# EAGLE design Julia ABL Board V2.1 (EAGLE 9.6.2)
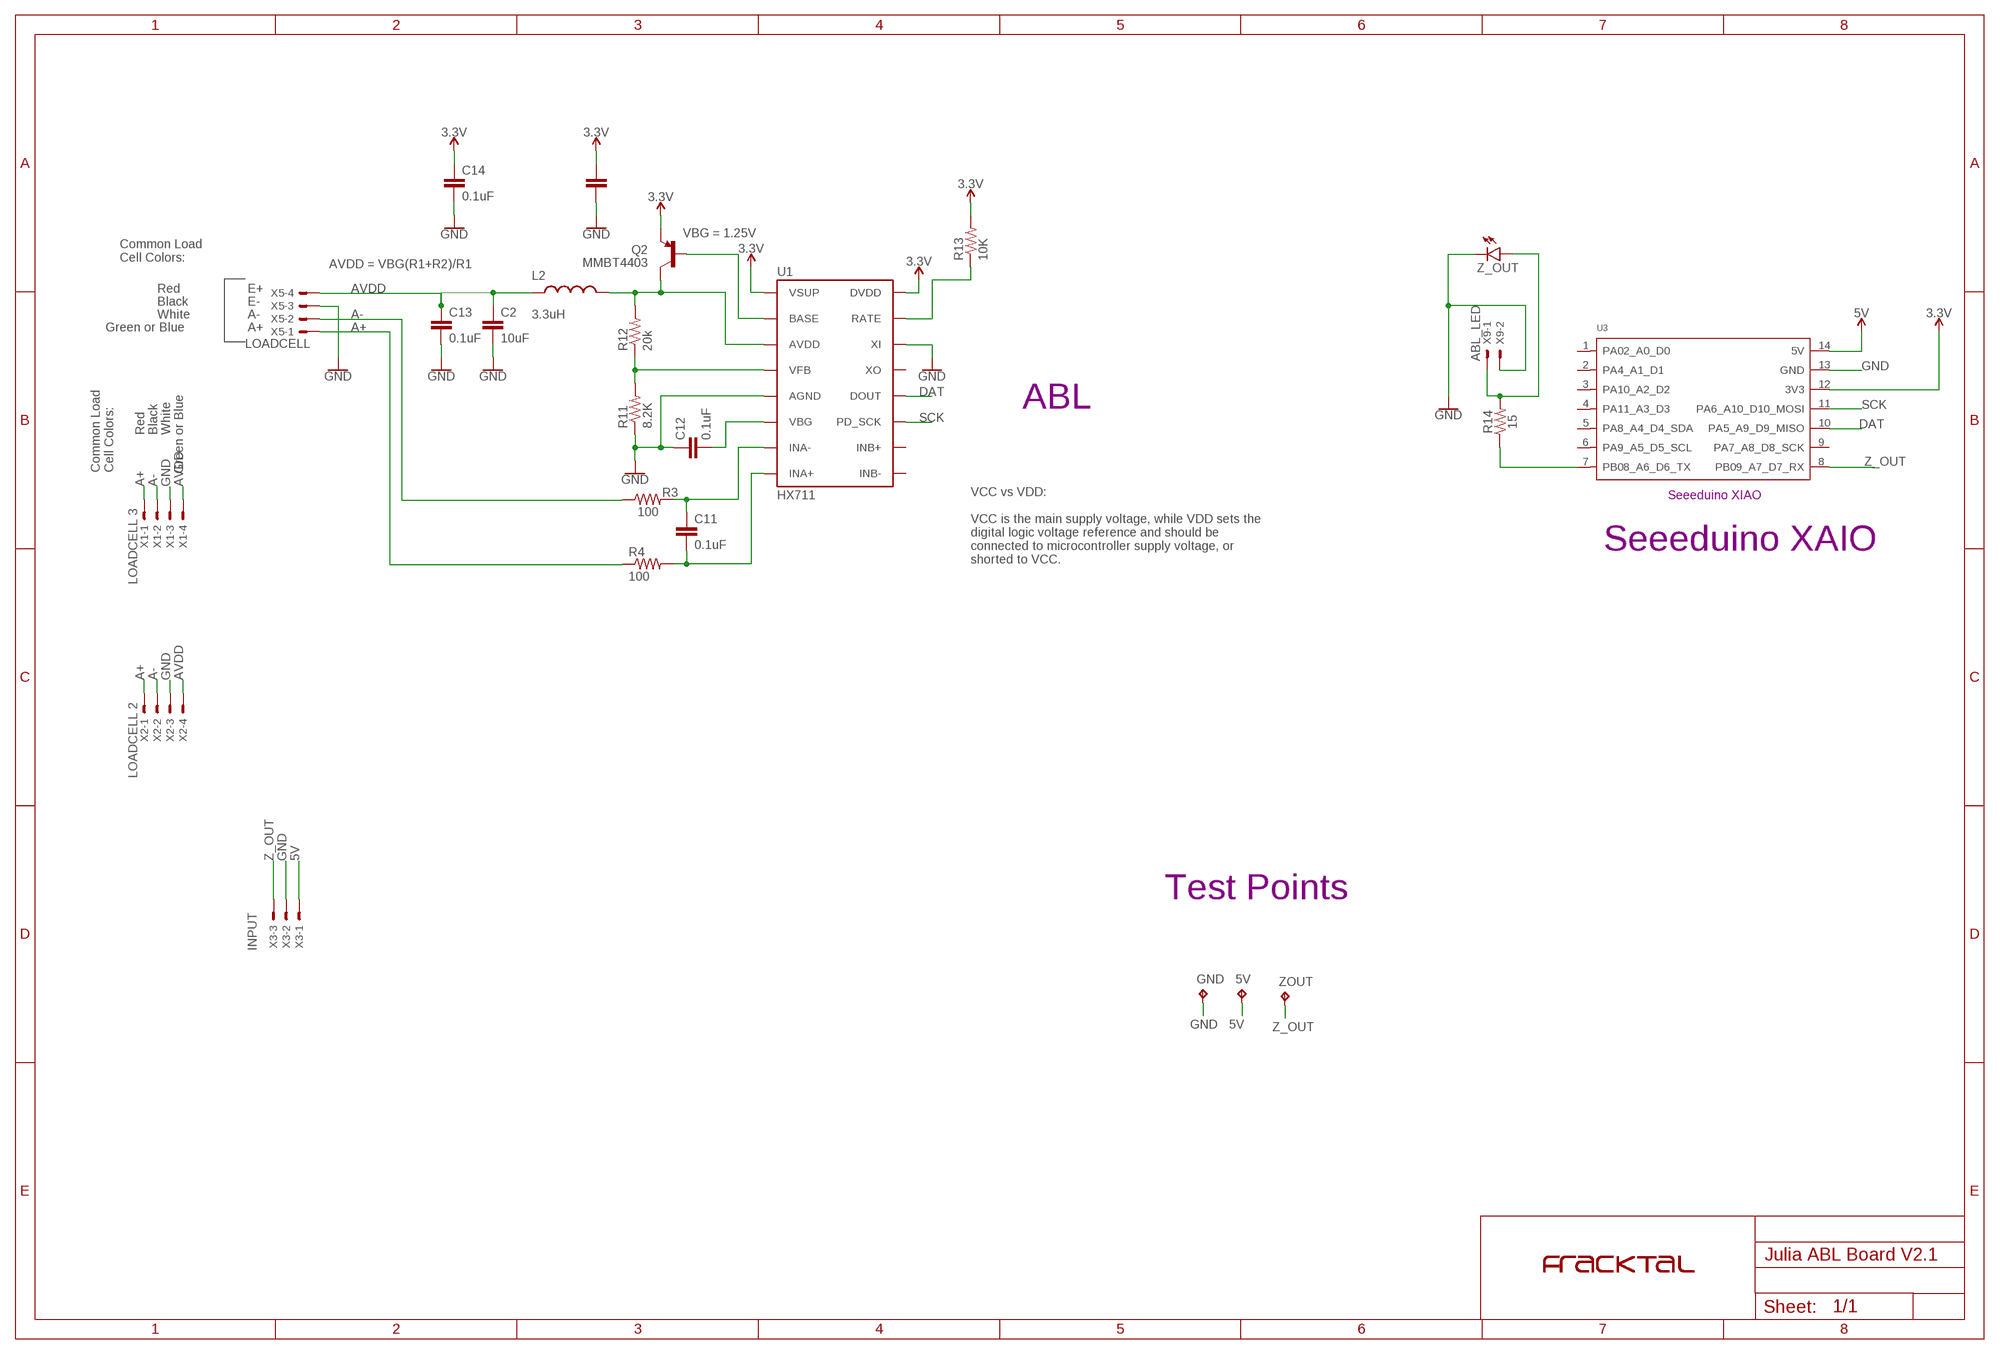
[diagram p0: schematic, sheet 1]

## Parts
5V  TPB2,54  [B2,54]
C1  10uF  10UF50V20%(1210)  [1210]
C2  10uF  10UF50V20%(1210)  [1210]
C11  0.1uF  0.1UF-25V-5%(0603)  [0603-CAP]
C12  0.1uF  0.1UF-25V-5%(0603)  [0603-CAP]
C13  0.1uF  0.1UF-25V-5%(0603)  [0603-CAP]
C14  0.1uF  0.1UF-25V-5%(0603)  [0603-CAP]
GND  TPB2,54  [B2,54]
L2  3.3uH  INDUCTOR0805-IND  [0805]
Q2  MMBT4403  TRANSISTOR_PNPMMBT4403  [SOT23-3]
R3  100  100OHM-1/10W-1%(0603)  [0603-RES]
R4  100  100OHM-1/10W-1%(0603)  [0603-RES]
R11  8.2K  8.2KOHM-1/10W-5%(0603)  [0603-RES]
R12  20k  20KOHM1/10W1%(0603)  [0603-RES]
R13  10K  10KOHM-1/10W-1%(0603)0603  [0603-RES]
R14  15  RESISTOR0603  [0603]
U1  HX711  HX711HX711  [SO16]
U3  MOUDLE-SEEEDUINO-XIAO  [MOUDLE14P-2.54-21X17.8MM]
U$2  FRACKTALLOGO  [FRACKTALLOGO]
X1  LOADCELL 3  JST-XH-04-PIN-LONG-PAD  [JST-XH-04-PACKAGE-LONG-PAD]
X2  LOADCELL 2  JST-XH-04-PIN-LONG-PAD  [JST-XH-04-PACKAGE-LONG-PAD]
X3  JST-XH-03-PIN-LONG-PAD  [JST-XH-03-PACKAGE-LONG-PAD]
X5  LOADCELL  JST-XH-04-PIN-LONG-PAD  [JST-XH-04-PACKAGE-LONG-PAD]
X9  ABL_LED  JST-XH-02-PIN-LONG-PAD  [JST-XH-02-PACKAGE-LONG-PAD]
Z_OUT  LEDSML0603  [SML0603]
ZOUT  TPB2,54  [B2,54]

## Nets
3.3V: C1.1 C14.1 Q2.2(E) R13.2 U1.1(VSUP) U1.16(DVDD) U3.12(3V3)
5V: 5V.TP U3.14(5V) X3.1
A+: R4.1 X1.1 X2.1 X5.1
A-: R3.1 X1.2 X2.2 X5.2
AVDD: C2.1 C13.1 L2.1 X1.4 X2.4 X5.4
DAT: U1.12(DOUT) U3.10(PA5_A9_D9_MISO)
GND: C1.2 C2.2 C12.1 C13.2 C14.2 GND.TP R11.1 U1.5(AGND) U1.14(XI) U3.13(GND) X1.3 X2.3 X3.2 X5.3 X9.2 Z_OUT.C
N$9: Q2.1(B) U1.2(BASE)
N$10: R11.2 R12.1 U1.4(VFB)
N$11: C12.2 U1.6(VBG)
N$12: L2.2 Q2.3(C) R12.2 U1.3(AVDD)
N$13: R13.1 U1.15(RATE)
N$15: C11.1 R3.2 U1.7(INA-)
N$16: C11.2 R4.2 U1.8(INA+)
N$17: R14.2 X9.1 Z_OUT.A
N$18: R14.1 U3.7(PB08_A6_D6_TX)
SCK: U1.11(PD_SCK) U3.11(PA6_A10_D10_MOSI)
Z_OUT: U3.8(PB09_A7_D7_RX) X3.3 ZOUT.TP
Unconnected: U1.9(INB-) U1.10(INB+) U1.13(XO) U3.1(PA02_A0_D0) U3.2(PA4_A1_D1) U3.3(PA10_A2_D2) U3.4(PA11_A3_D3) U3.5(PA8_A4_D4_SDA) U3.6(PA9_A5_D5_SCL) U3.9(PA7_A8_D8_SCK)

## Notes on the sheet
- VBG = 1.25V
- Common Load
  Cell Colors:
- AVDD = VBG(R1+R2)/R1
- Red | E+
- Black | E-
- White | A-
- Green or Blue | A+
- ABL
- Red | Black | White
- Common Load
  Cell Colors:
- Green or Blue
- Seeeduino XIAO
- Seeeduino XAIO
- VCC vs VDD:
  
  VCC is the main supply voltage, while VDD sets the
  digital logic voltage reference and should be
  connected to microcontroller supply voltage, or
  shorted to VCC.
- Test Points

## Library data of the parts
5V GND ZOUT = testpad:TP: Test pad
C1 C2 = SparkFun-Capacitors:10UF50V20%(1210): CAP-09824; PROD_ID: CAP-09824
C11-C14 = SparkFun-Capacitors:0.1UF-25V-5%(0603): CAP-08604; PROD_ID: CAP-08604
L2 = SparkFun-Passives:INDUCTOR: Inductors Basic Inductor/Choke - 0603 and 1206. Footprints are not proven and vary greatly between part numbers. INDUCTOR POWER 3.3UH 4.0A SMD 0.197" L x 0.197" W x 0.177" H (5.00mm x 5.00mm x 4.50mm); PROD_ID: NDUC-13076
Q2 = SparkFun-DiscreteSemi:TRANSISTOR_PNP: Generic PNP BJT Double check pinouts against datasheets- not all devices are the same! MMBT3906 - 40V 200mA SOT-23 (TRANS-08052) MMBT4403 - 40V 600mA SOT-23 (TRANS-09245); PROD_ID: TRANS-09245
R3 R4 = SparkFun-Resistors:100OHM-1/10W-1%(0603): RES-07863; PROD_ID: RES-07863
R11 = SparkFun-Resistors:8.2KOHM-1/10W-5%(0603): RES-10646; PROD_ID: RES-10646
R12 = SparkFun-Resistors:20KOHM1/10W1%(0603): RES-09383; PROD_ID: RES-09383
R13 = SparkFun-Resistors:10KOHM-1/10W-1%(0603): RES-00824; PROD_ID: RES-00824
R14 = SparkFun-Resistors:RESISTOR: Generic Resistor Package
U1 = Testing:HX711; PROD_ID: IC-12445
U3 = Seeeduino XIAO:MOUDLE-SEEEDUINO-XIAO
U$2 = FracktalWorks_Eagle_Library:FRACKTALLOGO
X1 X2 X5 = Rembrandt Electronics - JST XH Connectors v1-0:JST-XH-04-PIN: JST XH Connector 2 Pin Wire to board connector. Pitch: 2,54 mm, (0.100") Number of pins: 4 Created by Rembrandt Electronics www.rembrandtelectronics.com
X3 = Rembrandt Electronics - JST XH Connectors v1-0:JST-XH-03-PIN: JST XH Connector 2 Pin Wire to board connector. Pitch: 2,54 mm, (0.100") Number of pins: 3 Created by Rembrandt Electronics www.rembrandtelectronics.com; VALUE1: INPUT
X9 = Rembrandt Electronics - JST XH Connectors v1-0:JST-XH-02-PIN: JST XH Connector 2 Pin Wire to board connector. Pitch: 2,54 mm, (0.100") Number of pins: 2 Created by Rembrandt Electronics www.rembrandtelectronics.com
Z_OUT = led:LED: LED OSRAM: - CHIPLED LG R971, LG N971, LY N971, LG Q971, LY Q971, LO R971, LY R971 LH N974, LH R974 LS Q976, LO Q976, LY Q976 LO Q996 - Hyper CHIPLED LW Q18S LB Q993, LB Q99A, LB R99A - SideLED LS A670, LO A670, LY A670, LG A670, LP A670 LB A673, LV A673, LT A673, LW A673 LH A674 LY A675 LS A676, LA A676, LO A676, LY A676, LW A676 LS A679, LY A679, LG A679 - Hyper Micro SIDELED® LS Y876, LA Y876, LO Y876, LY Y876 LT Y87S - SmartLED LW L88C, LW L88S LB L89C, LB L89S, LG L890 LS L89K, LO L89K, LY L89K LS L896, LA L896, LO L896, LY L896 - TOPLED LS T670, LO T670, LY T670, LG T670, LP T670 LSG T670, LSP T670, LSY T670, LOP T670, LYG T670 LG T671, LOG T671, LSG T671 LB T673, LV T673, LT T673, LW T673 LH T674 LS T676, LA T676, LO T676, LY T676, LB T676, LH T676, LSB T676, LW T676 LB T67C, LV T67C, LT T67C, LS T67K, LO T67K, LY T67K, LW E67C LS E67B, LA E67B, LO E67B, LY E67B, LB E67C, LV E67C, LT E67C LW T67C LS T679, LY T679, LG T679 LS T770, LO T770, LY T770, LG T770, LP T770 LB T773, LV T773, LT T773, LW T773 LH T774 LS E675, LA E675, LY E675, LS T675 LS T776, LA T776, LO T776, LY T776, LB T776 LHGB T686 LT T68C, LB T68C - Hyper Mini TOPLED® LB M676 - Mini TOPLED Santana® LG M470 LS M47K, LO M47K, LY M47K Source: http://www.osram.convergy.de LUXEON: - LUMILED® LXK2-PW12-R00, LXK2-PW12-S00, LXK2-PW14-U00, LXK2-PW14-V00 LXK2-PM12-R00, LXK2-PM12-S00, LXK2-PM14-U00 LXK2-PE12-Q00, LXK2-PE12-R00, LXK2-PE12-S00, LXK2-PE14-T00, LXK2-PE14-U00 LXK2-PB12-K00, LXK2-PB12-L00, LXK2-PB12-M00, LXK2-PB14-N00, LXK2-PB14-P00, LXK2-PB14-Q00 LXK2-PR12-L00, LXK2-PR12-M00, LXK2-PR14-Q00, LXK2-PR14-R00 LXK2-PD12-Q00, LXK2-PD12-R00, LXK2-PD12-S00 LXK2-PH12-R00, LXK2-PH12-S00 LXK2-PL12-P00, LXK2-PL12-Q00, LXK2-PL12-R00 Source: www.luxeon.com KINGBRIGHT: KA-3528ASYC Source: www.kingbright.com

## Board
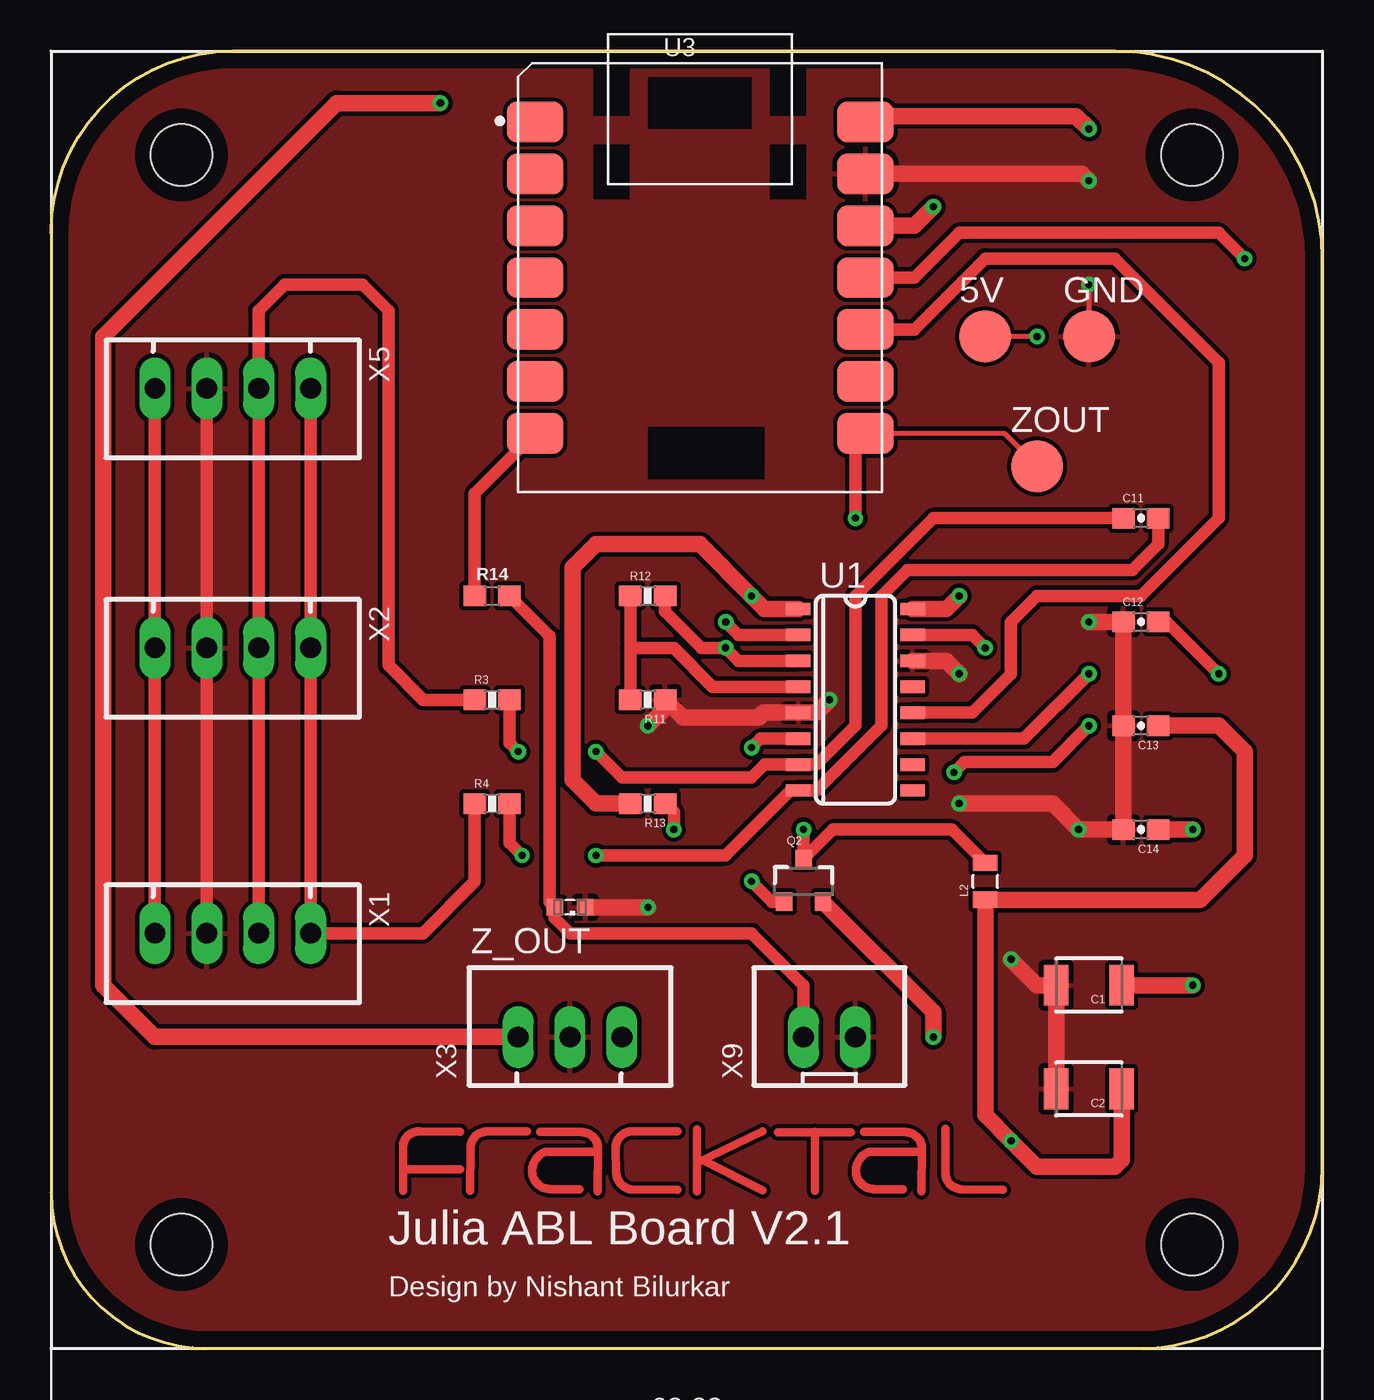
[diagram p1: board, top side]
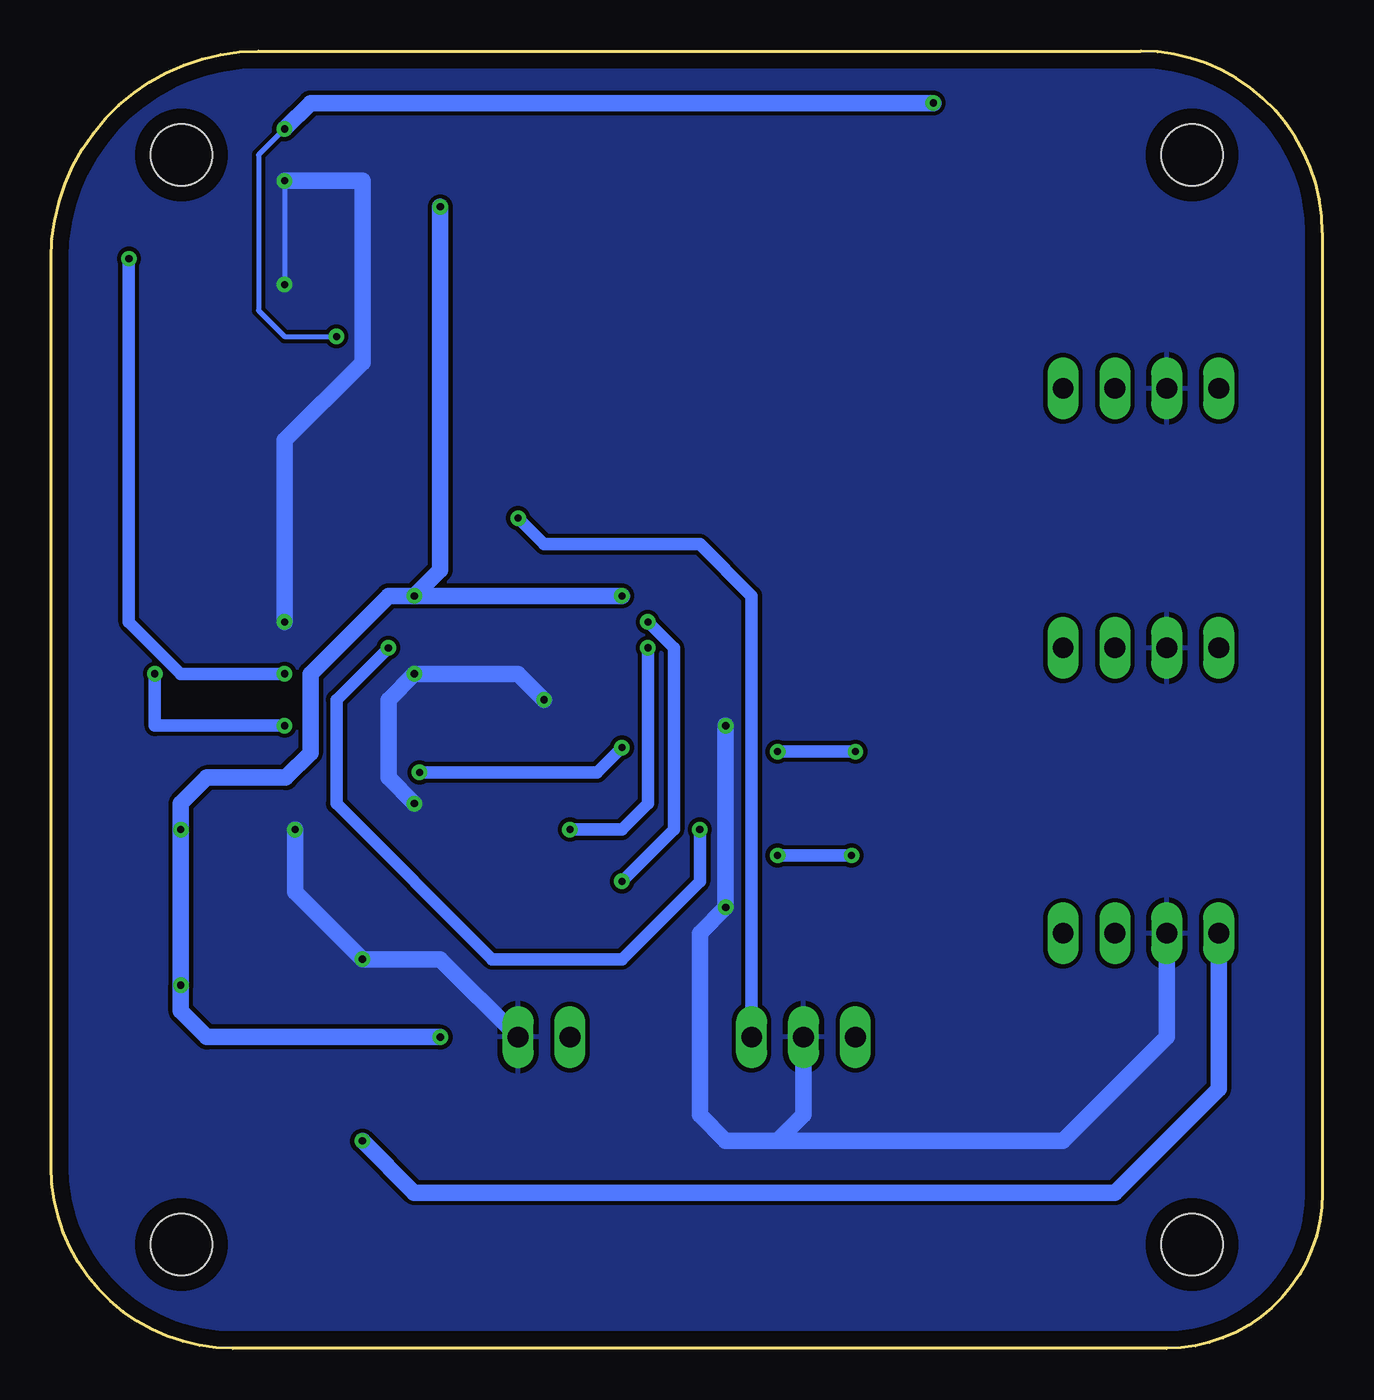
[diagram p2: board, bottom side, seen from below]

Size 62.23 x 63.5 mm. Coordinates in mm from the lower left corner, seen from the top.
Outline: 0,54.61 0,7.62 arc90 7.62,0 53.34,0 arc90 62.23,8.89 62.23,53.34 arc90 52.07,63.5 8.89,63.5 arc90 0,54.61
Copper layers (1*16): Top 0.035mm / dielectric 1.5mm / Bottom 0.035mm
Design rules "LionCircuits": minimum track width 8mil, minimum drill 0.35mm, track to track 8mil, track to pad 8mil, pad to pad 8mil, via to via 8mil, smd to smd 8mil, copper to edge 30mil, drill to drill 10mil, minimum pad ring 10mil, minimum via ring 8mil, stop-mask expansion 4mil, vias tented up to drill 0mil, thermal gap 10mil
Holes 3 mm at 6.38,58.42 6.38,5.08 55.85,5.08 55.85,58.42

### Footprints (pad centres in the part's own frame; a part is rotated, then mirrored left to right if it is on the bottom)
B2,54 = smd 2.54 x 2.54: TP 0,0
1210 = smd 1.2 x 2: 1 -1.6,0; 2 1.6,0
0603-CAP = smd 1.1 x 1: 1 -0.85,0; 2 0.85,0
0805 = smd 0.8 x 1.2: 1 -0.9,0; 2 0.9,0
SOT23-3 = smd 0.8 x 0.9: 1 -0.95,-1; 2 0.95,-1; 3 0,1.1
0603-RES = smd 1.1 x 1: 1 -0.85,0; 2 0.85,0
0603 = smd 1.1 x 1: 1 -0.85,0; 2 0.85,0
SO16 = smd 0.6 x 1.2: 1 -4.445,-2.8; 2 -3.175,-2.8; 3 -1.905,-2.8; 4 -0.635,-2.8; 5 0.635,-2.8; 6 1.905,-2.8; 7 3.175,-2.8; 8 4.445,-2.8; 9 4.445,2.8; 10 3.175,2.8; 11 1.905,2.8; 12 0.635,2.8; 13 -0.635,2.8; 14 -1.905,2.8; 15 -3.175,2.8; 16 -4.445,2.8
MOUDLE14P-2.54-21X17.8MM = smd 2.75 x 2: 1 0.835,18.12; 2 0.835,15.58; 3 0.835,13.04; 4 0.835,10.5; 5 0.835,7.96; 6 0.835,5.42; 7 0.835,2.88; 8 17,2.88; 9 17,5.42; 10 17,7.96; 11 17,10.5; 12 17,13.04; 13 17,15.58; 14 17,18.12
JST-XH-04-PACKAGE-LONG-PAD = drill 1.016 long: 1 -3.81,0; 2 -1.27,0; 3 1.27,0; 4 3.81,0
JST-XH-03-PACKAGE-LONG-PAD = drill 1.016 long: 1 -2.54,0; 2 0,0; 3 2.54,0
JST-XH-02-PACKAGE-LONG-PAD = drill 1.016 long: 1 -1.27,0; 2 1.27,0
SML0603 = smd 0.8 x 0.8: A 0.75,0; C -0.75,0

### Placement (x,y rotation side)
5V  45.72,49.53 0 top
C1  50.8,17.78 180 top
C2  50.8,12.7 180 top
C11  53.34,40.64 0 top
C12  53.34,35.56 0 top
C13  53.34,30.48 180 top
C14  53.34,25.4 180 top
GND  50.8,49.53 0 top
L2  45.72,22.86 90 top
Q2  36.83,22.86 0 top
R3  21.59,31.75 0 top
R4  21.59,26.67 0 top
R11  29.21,31.75 180 top
R12  29.21,36.83 0 top
R13  29.21,26.67 180 top
R14  21.59,36.83 0 top
U1  39.37,31.75 270 top
U3  22.86,41.91 0 top
U$2  29.21,7.62 0 top
X1  8.89,20.32 180 top
X2  8.89,34.29 180 top
X3  25.4,15.24 0 top
X5  8.89,46.99 180 top
X9  38.1,15.24 0 top
Z_OUT  25.4,21.59 180 top
ZOUT  48.26,43.18 0 top

### Tracks (layer width: path | path; a pad name or v marks a point on that pad's centre or on a via)
3.3V  (via drill 0.35)
  Top 0.813: C14.1 v55.88,25.4 | v55.88,17.78 C1.1 | U3.12 42.25,54.95 v43.18,55.88 | v44.45,36.83 43.81,36.19 U1.16 | U1.1 34.92,36.19 v34.29,36.83 31.75,39.37 26.67,39.37 25.51,38.21 25.51,27.83 26.67,26.67 R13.2 | Q2.2 43.18,16.46 v43.18,15.24
  Bottom 0.813: v43.18,55.88 43.18,38.1 v44.45,36.83 | v34.29,36.83 v44.45,36.83 | v44.45,36.83 45.72,36.83 49.53,33.02 49.53,29.15 50.74,27.94 54.61,27.94 55.88,26.67 v55.88,25.4 v55.88,17.78 55.88,16.51 54.61,15.24 v43.18,15.24
5V  (via drill 0.35)
  Top 0.254: v48.26,49.53 5V.TP
  Top 0.813: X3.1 5.08,15.24 2.54,17.78 2.54,49.53 13.97,60.96 v19.05,60.96 | U3.14 40.15,60.32 50.17,60.32 v50.8,59.69
  Bottom 0.254: v50.8,59.69 52.07,58.42 52.07,50.8 50.8,49.53 v48.26,49.53
  Bottom 0.813: v19.05,60.96 49.53,60.96 v50.8,59.69
A+
  Top 0.61: X5.1 X2.1 X1.1 18.2,20.32 20.74,22.86 R4.1
A-
  Top 0.61: X1.2 X2.2 X5.2 10.16,50.8 11.43,52.07 15.24,52.07 16.51,50.8 16.51,33.44 18.2,31.75 R3.1
AVDD  (via drill 0.35)
  Top 0.61: X5.4 X2.4 X1.4
  Top 0.813: C2.1 52.4,9.22 52.07,8.89 48.26,8.89 v46.99,10.16 45.72,11.43 L2.1 56.25,21.96 58.42,24.13 58.42,29.21 57.15,30.48 C13.1
  Bottom 0.813: X1.4 5.08,12.7 10.16,7.62 44.45,7.62 v46.99,10.16
DAT
  Top 0.61: U3.10 42.25,49.87 45.72,53.34 52.07,53.34 57.15,48.26 57.15,40.64 53.34,36.83 48.26,36.83 46.99,35.56 46.99,33.02 45.09,31.11 U1.12
GND  (via drill 0.35)
  Top 0.254: v50.8,52.07 GND.TP
  Top 0.61: X5.3 X2.3 X1.3
  Top 0.813: v46.99,19.05 48.26,17.78 C1.2 C2.2 | Z_OUT.C v29.21,21.59 | v29.21,30.48 30.06,31.33 R11.1 30.92,30.89 34.65,30.89 34.88,31.11 U1.5 37.46,31.11 v38.1,31.75 | U1.14 43.81,33.66 v44.45,33.02 | v50.8,35.56 C12.1 C13.2 C14.2 v50.29,25.4 49.02,26.67 v44.45,26.67 | U3.13 50.46,57.49 v50.8,57.15
  Bottom 0.254: v50.8,57.15 v50.8,52.07
  Bottom 0.813: X9.2 43.18,19.05 v46.99,19.05 50.29,22.35 v50.29,25.4 | 26.67,10.16 29.21,10.16 30.48,11.43 30.48,20.32 v29.21,21.59 v29.21,30.48 | 26.67,10.16 25.4,11.43 X3.2 | X1.3 7.62,15.24 12.7,10.16 26.67,10.16 | v44.45,26.67 45.72,27.94 45.72,31.75 v44.45,33.02 39.37,33.02 v38.1,31.75 | v50.8,35.56 50.8,44.45 46.99,48.26 46.99,57.15 v50.8,57.15
  pour Top: 0,63.5 62.23,63.5 62.23,0 0,0
  pour Bottom: 0,63.5 62.23,63.5 62.23,0 0,0
N$9  (via drill 0.35)
  Top 0.61: Q2.1 35.29,21.86 v34.29,22.86 | v33.02,35.56 33.66,34.92 U1.2
  Bottom 0.61: v34.29,22.86 31.75,25.4 31.75,34.29 v33.02,35.56
N$10
  Top 0.61: R12.1 28.36,34.29 | 28.36,34.29 R11.2 | U1.4 32.38,32.39 30.48,34.29 28.36,34.29
N$11  (via drill 0.35)
  Top 0.61: U1.6 34.73,29.85 v34.29,29.41 | C12.2 54.61,35.56 v57.15,33.02 | v44.2,28.19 44.7,28.7 49.02,28.7 v50.8,30.48
  Bottom 0.61: v50.8,30.48 57.15,30.48 v57.15,33.02 | v44.2,28.19 35.51,28.19 v34.29,29.41
N$12  (via drill 0.35)
  Top 0.61: L2.2 44.08,25.4 38.27,25.4 Q2.3 v36.83,25.4 | U1.3 33.66,33.66 v33.02,34.29 31.84,34.29 30.06,36.07 R12.2
  Bottom 0.61: v36.83,25.4 34.29,25.4 33.02,26.67 v33.02,34.29
N$13  (via drill 0.35)
  Top 0.61: R13.1 30.48,26.25 v30.48,25.4 | v45.72,34.29 45.09,34.92 U1.15
  Bottom 0.61: v30.48,25.4 30.48,22.86 34.29,19.05 40.64,19.05 48.26,26.67 48.26,31.75 v45.72,34.29
N$15  (via drill 0.35)
  Top 0.61: C11.1 43.18,40.64 39.37,36.83 39.37,30.48 37.46,28.57 U1.7 34.92,28.57 34.29,27.94 27.94,27.94 v26.67,29.21 | R3.2 22.44,29.63 v22.86,29.21
  Bottom 0.61: v22.86,29.21 v26.67,29.21
N$16  (via drill 0.35)
  Top 0.61: C11.2 54.19,39.37 52.92,38.1 41.91,38.1 40.64,36.83 40.64,30.48 37.46,27.31 U1.8 36.2,27.31 33.02,24.13 v26.67,24.13 | R4.2 22.44,24.74 v23.05,24.13
  Bottom 0.61: v26.67,24.13 v23.05,24.13
N$17
  Top 0.61: X9.1 36.83,17.78 34.29,20.32 25.41,20.32 24.65,21.08 Z_OUT.A 24.4,21.84 24.4,34.87 R14.2
N$18
  Top 0.61: U3.7 20.74,41.83 R14.1
SCK  (via drill 0.35)
  Top 0.61: v58.42,53.34 57.15,54.61 44.45,54.61 42.25,52.41 U3.11 | U1.11 47.62,29.85 v50.8,33.02
  Bottom 0.61: v50.8,33.02 55.88,33.02 58.42,35.56 v58.42,53.34
Z_OUT  (via drill 0.35)
  Top 0.254: U3.8 46.65,44.79 ZOUT.TP
  Top 0.61: U3.8 39.37,44.3 v39.37,40.64
  Bottom 0.61: v39.37,40.64 38.1,39.37 30.48,39.37 27.94,36.83 X3.3

### Text on the board
tPlace: Julia ABL Board V2.1 | Design by Nishant Bilurkar